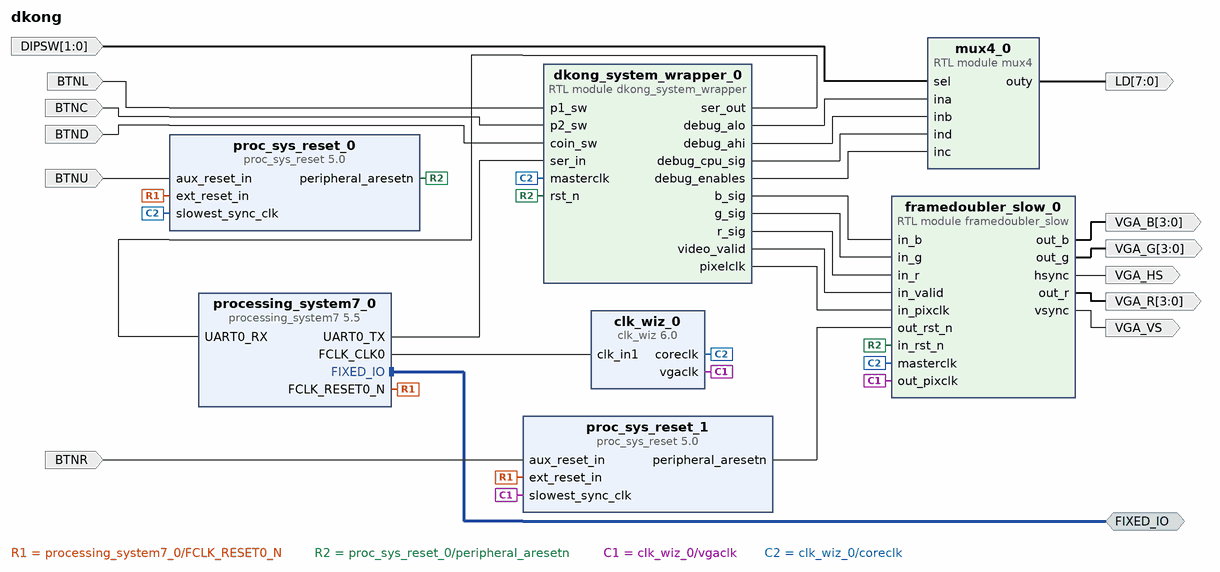
[diagram p0: block diagram of the top level]
# Vivado block design dkong, xc7z020clg484-1, Vivado 2019.1
create_bd_design dkong

create_bd_intf_port -mode Master -vlnv xilinx.com:display_processing_system7:fixedio_rtl:1.0 FIXED_IO
create_bd_port -dir I -type rst BTNU
set_property -dict {CONFIG.POLARITY ACTIVE_HIGH} [get_bd_ports BTNU]
create_bd_port -dir I -from 1 -to 0 DIPSW
create_bd_port -dir O -from 7 -to 0 LD
create_bd_port -dir O -from 3 -to 0 VGA_R
create_bd_port -dir O -from 3 -to 0 VGA_G
create_bd_port -dir O -from 3 -to 0 VGA_B
create_bd_port -dir O VGA_HS
create_bd_port -dir O VGA_VS
create_bd_port -dir I BTNL
create_bd_port -dir I BTNC
create_bd_port -dir I BTND
create_bd_port -dir I -type rst BTNR
set_property -dict {CONFIG.POLARITY ACTIVE_HIGH} [get_bd_ports BTNR]

create_bd_cell -type ip -vlnv xilinx.com:ip:processing_system7:5.5 processing_system7_0
set_property -dict [list \
  CONFIG.PCW_FPGA0_PERIPHERAL_FREQMHZ 100 \
  CONFIG.PCW_UART0_PERIPHERAL_ENABLE 1 \
  CONFIG.PCW_UART0_UART0_IO EMIO \
  CONFIG.PCW_UART_PERIPHERAL_FREQMHZ 100 \
  CONFIG.PCW_UIPARAM_DDR_ENABLE 0 \
  CONFIG.PCW_USE_M_AXI_GP0 0 \
] [get_bd_cells processing_system7_0]
# 34 more settings of processing_system7_0 are not shown: defaults, MIO pin electricals, DDR timing, and values the tool derives
create_bd_cell -type ip -vlnv xilinx.com:ip:proc_sys_reset:5.0 proc_sys_reset_0
set_property -dict {CONFIG.C_AUX_RESET_HIGH 1} [get_bd_cells proc_sys_reset_0]
create_bd_cell -type module -reference mux4 mux4_0
set_property -dict {CONFIG.WIDTH 8} [get_bd_cells mux4_0]
create_bd_cell -type ip -vlnv xilinx.com:ip:clk_wiz:6.0 clk_wiz_0
set_property -dict [list \
  CONFIG.CLKOUT1_JITTER 253.110 \
  CONFIG.CLKOUT1_PHASE_ERROR 303.436 \
  CONFIG.CLKOUT1_REQUESTED_OUT_FREQ 25.175 \
  CONFIG.CLKOUT2_JITTER 218.660 \
  CONFIG.CLKOUT2_PHASE_ERROR 303.436 \
  CONFIG.CLKOUT2_REQUESTED_OUT_FREQ 61.44 \
  CONFIG.CLKOUT2_USED true \
  CONFIG.CLK_OUT1_PORT vgaclk \
  CONFIG.CLK_OUT2_PORT coreclk \
  CONFIG.MMCM_CLKFBOUT_MULT_F 58.375 \
  CONFIG.MMCM_CLKOUT0_DIVIDE_F 46.375 \
  CONFIG.MMCM_CLKOUT1_DIVIDE 19 \
  CONFIG.MMCM_DIVCLK_DIVIDE 5 \
  CONFIG.NUM_OUT_CLKS 2 \
  CONFIG.RESET_PORT resetn \
  CONFIG.RESET_TYPE ACTIVE_LOW \
  CONFIG.USE_LOCKED false \
  CONFIG.USE_RESET false \
] [get_bd_cells clk_wiz_0]
create_bd_cell -type ip -vlnv xilinx.com:ip:proc_sys_reset:5.0 proc_sys_reset_1
create_bd_cell -type module -reference framedoubler_slow framedoubler_slow_0
create_bd_cell -type module -reference dkong_system_wrapper dkong_system_wrapper_0
set_property -dict {CONFIG.IN2_ENA 1} [get_bd_cells dkong_system_wrapper_0]

# ---- connections ----

connect_bd_intf_net [get_bd_intf_ports FIXED_IO] [get_bd_intf_pins processing_system7_0/FIXED_IO]
connect_bd_net [get_bd_pins processing_system7_0/FCLK_RESET0_N] \
  [get_bd_pins proc_sys_reset_0/ext_reset_in] [get_bd_pins proc_sys_reset_1/ext_reset_in]
connect_bd_net -net sel_0_1 [get_bd_ports DIPSW] [get_bd_pins mux4_0/sel]
connect_bd_net [get_bd_pins mux4_0/outy] [get_bd_ports LD]
connect_bd_net [get_bd_pins proc_sys_reset_0/peripheral_aresetn] [get_bd_pins framedoubler_slow_0/in_rst_n] [get_bd_pins dkong_system_wrapper_0/rst_n]
connect_bd_net [get_bd_pins dkong_system_wrapper_0/debug_alo] [get_bd_pins mux4_0/ina]
connect_bd_net [get_bd_pins dkong_system_wrapper_0/debug_ahi] [get_bd_pins mux4_0/inb]
connect_bd_net [get_bd_pins dkong_system_wrapper_0/debug_cpu_sig] [get_bd_pins mux4_0/ind]
connect_bd_net [get_bd_pins dkong_system_wrapper_0/ser_out] [get_bd_pins processing_system7_0/UART0_RX]
connect_bd_net [get_bd_pins processing_system7_0/UART0_TX] [get_bd_pins dkong_system_wrapper_0/ser_in]
connect_bd_net [get_bd_pins dkong_system_wrapper_0/debug_enables] [get_bd_pins mux4_0/inc]
connect_bd_net -net BTNC_1 [get_bd_ports BTNU] [get_bd_pins proc_sys_reset_0/aux_reset_in]
connect_bd_net [get_bd_pins clk_wiz_0/vgaclk] [get_bd_pins proc_sys_reset_1/slowest_sync_clk] [get_bd_pins framedoubler_slow_0/out_pixclk]
connect_bd_net [get_bd_pins processing_system7_0/FCLK_CLK0] [get_bd_pins clk_wiz_0/clk_in1]
connect_bd_net [get_bd_pins clk_wiz_0/coreclk] \
  [get_bd_pins proc_sys_reset_0/slowest_sync_clk] [get_bd_pins framedoubler_slow_0/masterclk] \
  [get_bd_pins dkong_system_wrapper_0/masterclk]
connect_bd_net [get_bd_pins proc_sys_reset_1/peripheral_aresetn] [get_bd_pins framedoubler_slow_0/out_rst_n]
connect_bd_net [get_bd_pins dkong_system_wrapper_0/b_sig] [get_bd_pins framedoubler_slow_0/in_b]
connect_bd_net [get_bd_pins dkong_system_wrapper_0/g_sig] [get_bd_pins framedoubler_slow_0/in_g]
connect_bd_net [get_bd_pins dkong_system_wrapper_0/r_sig] [get_bd_pins framedoubler_slow_0/in_r]
connect_bd_net [get_bd_pins dkong_system_wrapper_0/video_valid] [get_bd_pins framedoubler_slow_0/in_valid]
connect_bd_net [get_bd_pins dkong_system_wrapper_0/pixelclk] [get_bd_pins framedoubler_slow_0/in_pixclk]
connect_bd_net [get_bd_pins framedoubler_slow_0/out_r] [get_bd_ports VGA_R]
connect_bd_net [get_bd_pins framedoubler_slow_0/out_g] [get_bd_ports VGA_G]
connect_bd_net [get_bd_pins framedoubler_slow_0/out_b] [get_bd_ports VGA_B]
connect_bd_net [get_bd_pins framedoubler_slow_0/hsync] [get_bd_ports VGA_HS]
connect_bd_net [get_bd_pins framedoubler_slow_0/vsync] [get_bd_ports VGA_VS]
connect_bd_net -net p1_sw_0_1 [get_bd_ports BTNL] [get_bd_pins dkong_system_wrapper_0/p1_sw]
connect_bd_net -net p2_sw_0_1 [get_bd_ports BTNC] [get_bd_pins dkong_system_wrapper_0/p2_sw]
connect_bd_net -net coin_sw_0_1 [get_bd_ports BTND] [get_bd_pins dkong_system_wrapper_0/coin_sw]
connect_bd_net -net aux_reset_in_0_1 [get_bd_ports BTNR] [get_bd_pins proc_sys_reset_1/aux_reset_in]

validate_bd_design
save_bd_design
